# Altium schematic sheet Logic_Power.SchDoc
size Legal; SheetNumber: 6; SheetTotal: 6; SPICEModelCacheVPXTNZOZ: <root> / <DocumentId>VPXTNZOZ</DocumentId> / <CacheFrame Number="0"> / <Model Name="cap" Kind="MDL"> / <Text>*Default semiconductor capacitor / .MODEL CAP C()</Text> / </Model> / </CacheFrame> / </root>
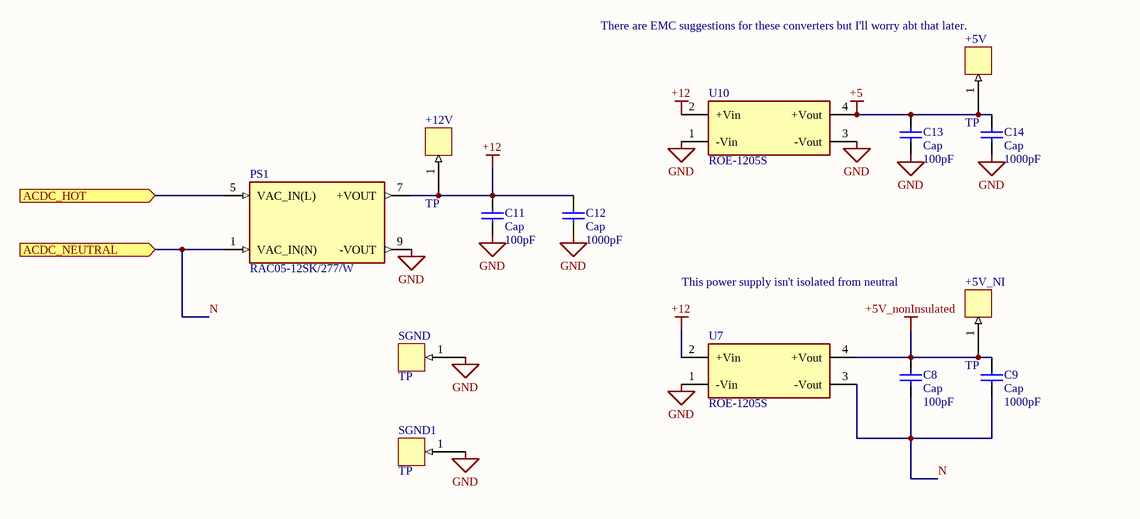
[diagram p0: Logic_Power.SchDoc]

## Parts
+5V  TP  [TP]
+5V_NI  TP  [TP]
+12V  TP  [TP]
C8  Cap  value 100pF  [0603]
C9  Cap  value 1000pF  [0603]
C11  Cap  value 100pF  [0603]
C12  Cap  value 1000pF  [0603]
C13  Cap  value 100pF  [0603]
C14  Cap  value 1000pF  [0603]
PS1  RAC05-12SK/277/W  [CONV_RAC05-12SK/277/W]
SGND  TP  [TP]
SGND1  TP  [TP]
U7  ROE-1205S  [FP-ROE-0505S-MFG]
U10  ROE-1205S  [FP-ROE-0505S-MFG]

## Ports
ACDC_HOT (in), ACDC_NEUTRAL (in)

## Nets
+5: +5V.1 C13.2 C14.2 U10.4(+Vout)
+5V_nonInsulated: +5V_NI.1 C8.2 C9.2 U7.4(+Vout)
+12: +12V.1 C11.2 C12.2 PS1.7(+VOUT) U7.2(+Vin) U10.2(+Vin)
GND: C11.1 C12.1 C13.1 C14.1 PS1.9(-VOUT) SGND.1 SGND1.1 U7.1(-Vin) U10.1(-Vin) U10.3(-Vout)
ACDC_HOT: PS1.5(VAC_IN(L)) ; port ACDC_HOT
N: C8.1 C9.1 PS1.1(VAC_IN(N)) U7.3(-Vout) ; port ACDC_NEUTRAL

## Notes on the sheet
- (near +5V) There are EMC suggestions for these converters but I'll worry abt that later.
- (near +5V_NI) This power supply isn't isolated from neutral

## Library data of the parts
C8 C9 C11-C14 = Cap: Capacitor; Published: 8-Jun-2000; LatestRevisionDate: 17-Jul-2002; LatestRevisionNote: Re-released for DXP Platform.; PackageReference: RAD-0.3; Publisher: Altium Limited; PackageDescription: Radial Cap, Thru-Hole; 2 Leads; 0.3 in Pin Spacing
PS1 = RAC05-12SK/277/W: 5W AC/DC-Converter 'POWERLINE' W 4kV reg; MF: Recom Power; SnapEDA_Link: https://www.snapeda.com/parts/RAC05-12SK/277/W/Recom%20Power/view-part/3227993/?ref=snap; Price: None; Availability: Unavailable; MP: RAC05-12SK/277/W; Value: *; Package: Recom Power
U7 U10 = CMP-29842-000013-1: DC DC CONVERTER 5V 1W; Efficiency: 75%; Current - Output 1: 200mA; Isolation: Isolated; Max Input Voltage: 5.5V; Min Input Voltage: 4.5V; Number of Outputs: 1; Isolation Voltage: 1kV; RoHS Compliant: Yes; Depth: 6mm; Height: 10mm; Max Output Voltage: 5V; Power Rating: 1W; Case/Package: SIP; Nominal Output Voltage: 5V; Weight: 1.4g; Min Operating Temperature: -40°C; Max Output Current: 200mA; Output Power: 1W; Min Input Voltage (DC): 4.5V; Max Power Dissipation: 1W; REACH SVHC: No SVHC; Series: ROE; Output Current: 200mA; Width: 6mm; Number of Pins: 4; Package Quantity: 42; Lead Free: Lead Free; Mount: Through Hole; Packaging: Rail/Tube; Length: 11.5mm; Output Voltage: 5V; Max Operating Temperature: 85°C; Voltage - Output 1: 5V; Nominal Input Voltage: 5V; Max Input Voltage (DC): 5.5V; Max Output Power: 1W